# EAGLE design Drobit_ExtensionPanel (EAGLE 7.5.0)
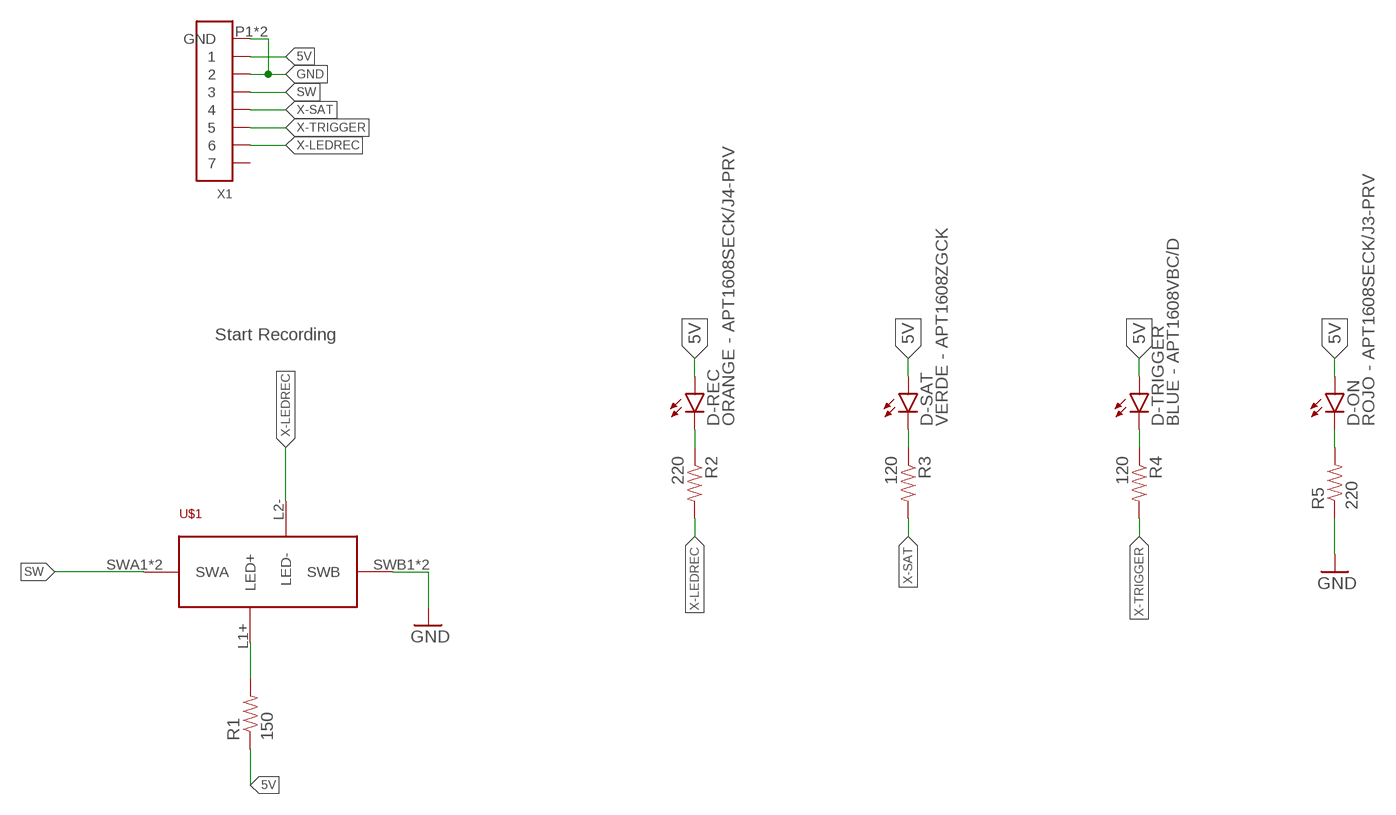
[diagram p0: schematic, sheet 1]

## Parts
D-ON  ROJO - APT1608SECK/J3-PRV  LED3MM  [LED3MM]
D-REC  ORANGE - APT1608SECK/J4-PRV  LED3MM  [LED3MM]
D-SAT  VERDE - APT1608ZGCK  LED3MM  [LED3MM]
D-TRIGGER  BLUE - APT1608VBC/D  LED3MM  [LED3MM]
R1  150  RESISTOR1206  [1206]
R2  220  RESISTOR1206  [1206]
R3  120  RESISTOR1206  [1206]
R4  120  RESISTOR1206  [1206]
R5  220  RESISTOR1206  [1206]
U$1  PUSH-LED  [ITS13FV1ST]
X1  CONN_7-1  [JST-GH-7]

## Nets
5V [power]: D-ON.A D-REC.A D-SAT.A D-TRIGGER.A R1.1 X1.1
GND: R5.1 U$1.SWB1(SWB) U$1.SWB2(SWB) X1.2 X1.P1(GND) X1.P2(GND)
N$1: R1.2 U$1.L1+(LED+)
N$9: D-ON.K(C) R5.2
SW: U$1.SWA1(SWA) U$1.SWA2(SWA) X1.3
X-LEDREC: R2.2 U$1.L2-(LED-) X1.6
X-LEDREC--: D-REC.K(C) R2.1
X-SAT: R3.2 X1.4
X-SAT--: D-SAT.K(C) R3.1
X-TRIGGER: R4.2 X1.5
X-TRIGGER--: D-TRIGGER.K(C) R4.1
Unconnected: X1.7

## Notes on the sheet
- Start Recording

## Library data of the parts
D-ON = SparkFun-LED:LED: LEDs Standard schematic elements and footprints for 5mm, 3mm, 1206, and 0603 sized LEDs. 5mm - Spark Fun Electronics SKU : COM-00529 (and others); PARTNO: 604-APT1608SECKJ3PRV; PROD_ID: DIO-08794
D-REC = SparkFun-LED:LED: LEDs Standard schematic elements and footprints for 5mm, 3mm, 1206, and 0603 sized LEDs. 5mm - Spark Fun Electronics SKU : COM-00529 (and others); PARTNO: 604-APT1608SECKJ4PRV; PROD_ID: DIO-08794
D-SAT = SparkFun-LED:LED: LEDs Standard schematic elements and footprints for 5mm, 3mm, 1206, and 0603 sized LEDs. 5mm - Spark Fun Electronics SKU : COM-00529 (and others); PARTNO: 604-APT1608ZGCK; PROD_ID: DIO-08794
D-TRIGGER = SparkFun-LED:LED: LEDs Standard schematic elements and footprints for 5mm, 3mm, 1206, and 0603 sized LEDs. 5mm - Spark Fun Electronics SKU : COM-00529 (and others); PARTNO: 604-APT1608VBC/D; PROD_ID: DIO-08794
R1 = SparkFun-Passives:RESISTOR: Resistor Basic schematic elements and footprints for 0603, 1206, and PTH resistors.
R2 = SparkFun-Passives:RESISTOR: Resistor Basic schematic elements and footprints for 0603, 1206, and PTH resistors.; PARTNO: 667-ERJ-3GEYJ181V
R3 R4 = SparkFun-Passives:RESISTOR: Resistor Basic schematic elements and footprints for 0603, 1206, and PTH resistors.; PARTNO: 667-ERJ-3EKF1050V
R5 = SparkFun-Passives:RESISTOR: Resistor Basic schematic elements and footprints for 0603, 1206, and PTH resistors.; PARTNO: 667-ERJ-3EKF82R0V
U$1 = pushButton:PUSH-LED
X1 = jst-gh:CONN_7-1

## Board
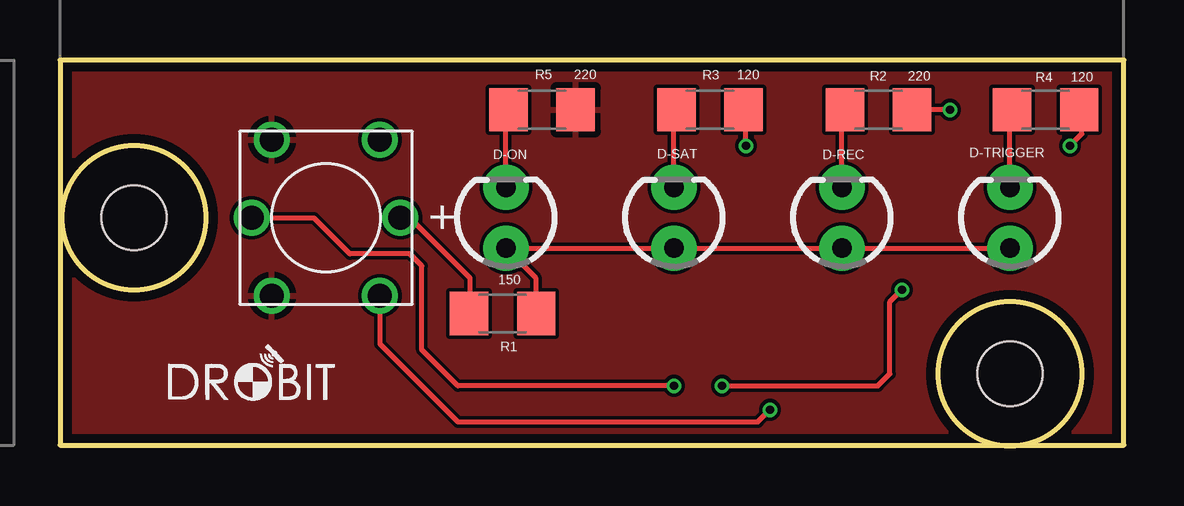
[diagram p1: board, top side]
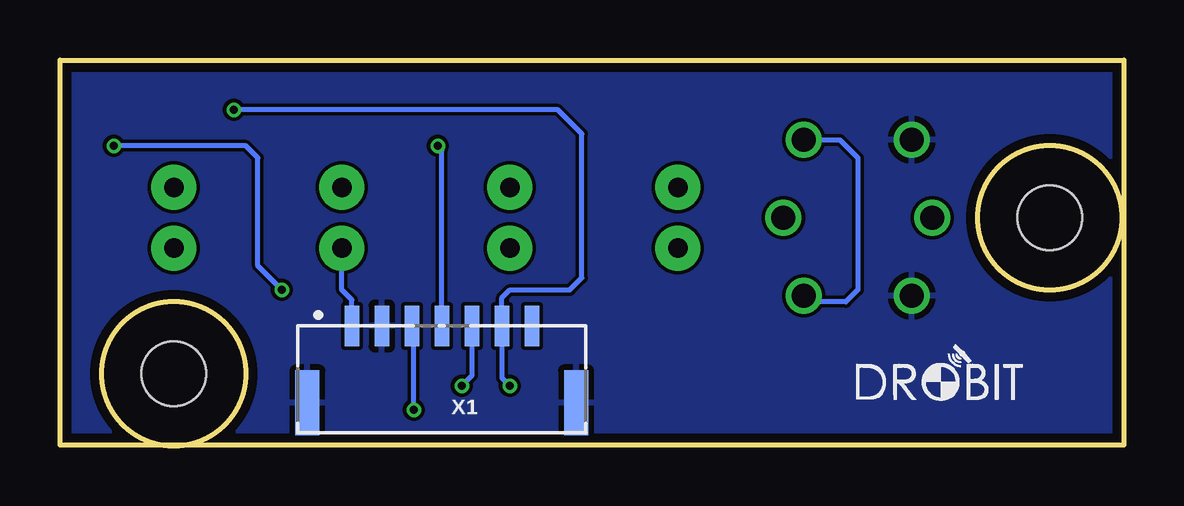
[diagram p2: board, bottom side, seen from below]

Size 44.32 x 16.07 mm. Coordinates in mm from the lower left corner, seen from the top.
Outline: 0,16.07 0,0.02 44.32,0.02 44.32,16.07 0,16.07
Outline: circle at 3.08,9.5 radius 3
Outline: circle at 39.58,3 radius 3
Copper layers (1*16): Top 0.035559375mm / dielectric 1.6mm / Bottom 0.035559375mm
Design rules "oshpark-2layer": minimum track width 6mil, minimum drill 10mil, track to track 6mil, track to pad 6mil, pad to pad 6mil, via to via 6mil, smd to smd 6mil, copper to edge 15mil, drill to drill 6mil, minimum pad ring 5mil, minimum via ring 5mil, stop-mask expansion 2.5mil, vias tented up to drill 0mil, thermal gap 10mil
Holes 2.7 mm at 3.08,9.5 39.58,3

### Footprints (pad centres in the part's own frame; a part is rotated, then mirrored left to right if it is on the bottom)
LED3MM = drill 0.813 pad 1.88: A -1.27,0; K 1.27,0
1206 = smd 1.6 x 1.8: 1 -1.4,0; 2 1.4,0
ITS13FV1ST = drill 1: L1+ -3.1,0; L2- 3.1,0; SWA1 -2.25,3.25; SWA2 -2.25,-3.25; SWB1 2.25,3.25; SWB2 2.25,-3.25
JST-GH-7 = smd 0.6 x 1.7: 1 3.75,-5.45; 2 2.5,-5.45; 3 1.25,-5.45; 4 0,-5.45; 5 -1.25,-5.45; 6 -2.5,-5.45; 7 -3.75,-5.45 | smd 1 x 2.7: P1 5.6,-2.25; P2 -5.6,-2.25

### Placement (x,y rotation side)
D-ON  18.58,9.5 90 top
D-REC  32.58,9.5 90 top
D-SAT  25.58,9.5 90 top
D-TRIGGER  39.58,9.5 90 top
R1  18.44,5.51 180 top
R2  34.1,14 0 top
R3  27.08,14 0 top
R4  41.07,14 0 top
R5  20.08,14 180 top
U$1  11.08,9.5 180 top
X1  28.41,-0.46 180 bottom

### Tracks (layer width: path | path; a pad name or v marks a point on that pad's centre or on a via)
5V
  Top 0.2: R1.1 19.84,6.97 D-ON.A D-SAT.A D-REC.A D-TRIGGER.A
  Bottom 0.2: X1.1 32.16,6.08 32.58,6.5 D-REC.A
GND
  pour Bottom: 0.08,16 0.08,0 44.08,0 44.08,16
  pour Top: 0.08,16 0.08,0 44.08,0 44.08,16
N$1
  Top 0.2: U$1.L1+ 14.58,9.5 17.08,7 17.08,5.55 R1.2
N$9
  Top 0.2: D-ON.K 18.58,13.9 R5.2
SW  (via drill 0.35)
  Top 0.2: U$1.SWA1 13.33,4.25 16.58,1 29.08,1 v29.58,1.5
  Bottom 0.2: U$1.SWA2 11.83,12.75 11.08,12 11.08,6.5 11.58,6 13.08,6 U$1.SWA1 | v29.58,1.5 29.58,4.91 X1.3
X-LEDREC  (via drill 0.35)
  Top 0.2: U$1.L2- 10.58,9.5 12.08,8 14.58,8 15.08,7.5 15.08,4 16.58,2.5 v25.58,2.5 | v37.08,14 R2.2
  Bottom 0.2: v25.58,2.5 25.91,2.83 X1.6 25.91,6.17 25.58,6.5 23.08,6.5 22.58,7 22.58,13 23.58,14 v37.08,14
X-LEDREC--
  Top 0.2: D-REC.K 32.58,13.88 R2.1
X-SAT  (via drill 0.35)
  Top 0.2: v28.58,12.5 28.58,13.9 R3.2
  Bottom 0.2: X1.4 28.41,12.33 v28.58,12.5
X-SAT--
  Top 0.2: D-SAT.K 25.58,13.9 R3.1
X-TRIGGER  (via drill 0.35)
  Top 0.2: v27.58,2.5 34.08,2.5 34.58,3 34.58,6 v35.08,6.5 | v42.08,12.5 42.58,13 42.58,13.88 R4.2
  Bottom 0.2: X1.5 27.16,2.92 v27.58,2.5 | v35.08,6.5 36.08,7.5 36.08,12 36.58,12.5 v42.08,12.5
X-TRIGGER--
  Top 0.2: D-TRIGGER.K 39.58,13.92 R4.1

### Text on the board
tNames: 220 | 120 | 220 | 120 | +